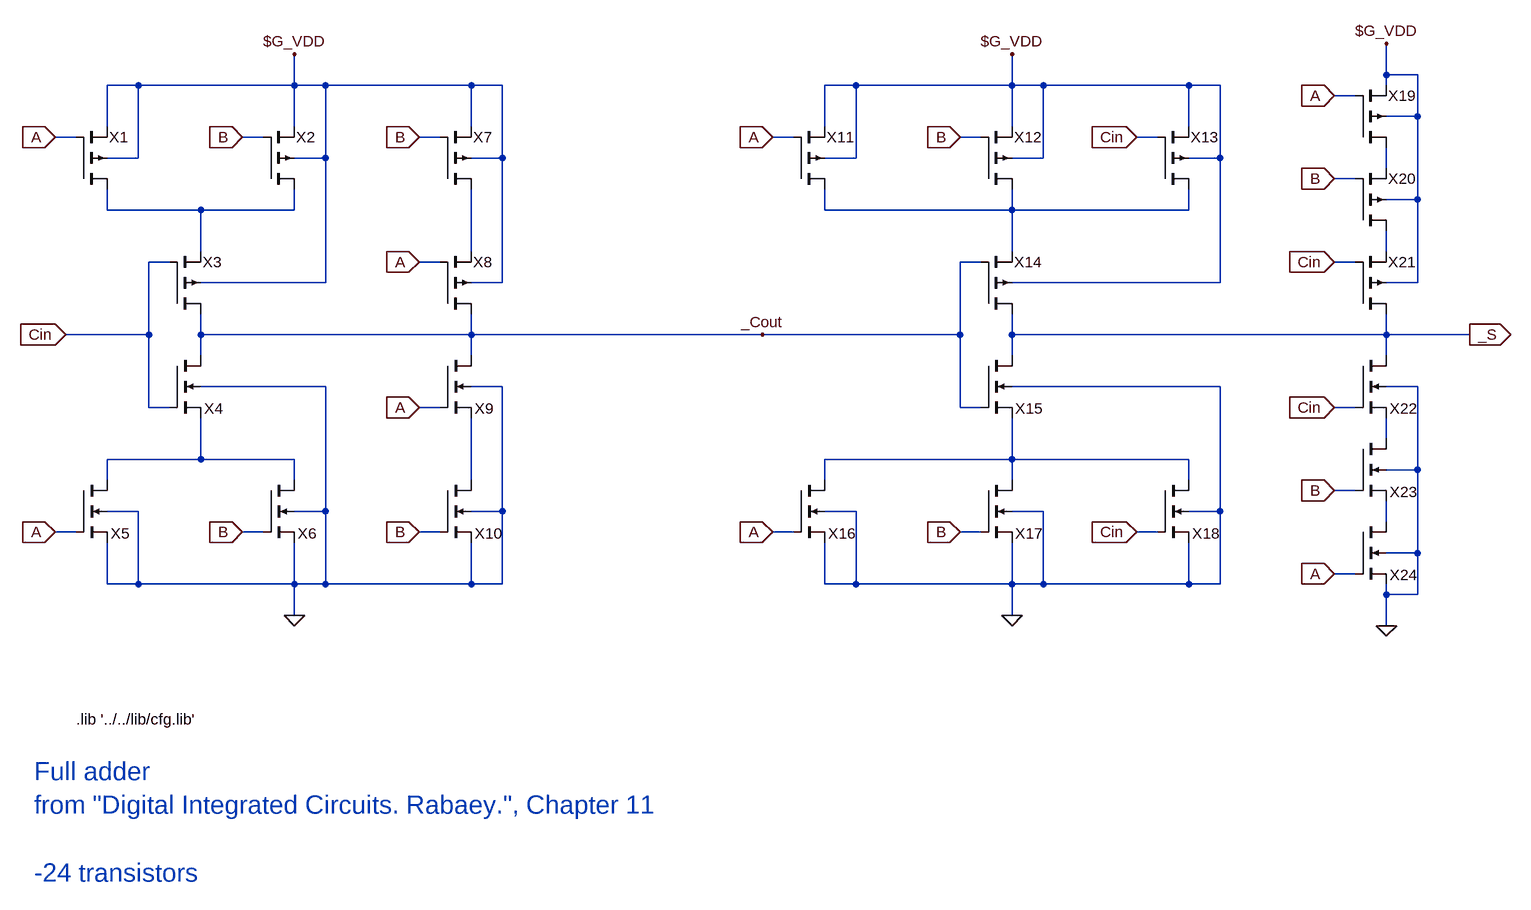
[diagram p0: schematic fa3.asc]
fa3.asc, the LTspice schematic file:
Version 4
SHEET 1 2652 2208
WIRE -3024 896 -3024 848
WIRE -2976 896 -3024 896
WIRE -4944 912 -4992 912
WIRE -4704 912 -4704 864
WIRE -4704 912 -4944 912
WIRE -4656 912 -4704 912
WIRE -4432 912 -4656 912
WIRE -4384 912 -4432 912
WIRE -3840 912 -3888 912
WIRE -3600 912 -3600 864
WIRE -3600 912 -3840 912
WIRE -3552 912 -3600 912
WIRE -3328 912 -3552 912
WIRE -3280 912 -3328 912
WIRE -3024 912 -3024 896
WIRE -3072 928 -3104 928
WIRE -2976 960 -2976 896
WIRE -2976 960 -3024 960
WIRE -4992 976 -4992 912
WIRE -4704 976 -4704 912
WIRE -4432 976 -4432 912
WIRE -3888 976 -3888 912
WIRE -3600 976 -3600 912
WIRE -3328 976 -3328 912
WIRE -5040 992 -5072 992
WIRE -4752 992 -4784 992
WIRE -4480 992 -4512 992
WIRE -3936 992 -3968 992
WIRE -3648 992 -3680 992
WIRE -3376 992 -3408 992
WIRE -4944 1024 -4944 912
WIRE -4944 1024 -4992 1024
WIRE -4656 1024 -4656 912
WIRE -4656 1024 -4704 1024
WIRE -4384 1024 -4384 912
WIRE -4384 1024 -4432 1024
WIRE -3840 1024 -3840 912
WIRE -3840 1024 -3888 1024
WIRE -3552 1024 -3552 912
WIRE -3552 1024 -3600 1024
WIRE -3280 1024 -3280 912
WIRE -3280 1024 -3328 1024
WIRE -3024 1040 -3024 1008
WIRE -3072 1056 -3104 1056
WIRE -2976 1088 -2976 960
WIRE -2976 1088 -3024 1088
WIRE -4992 1104 -4992 1072
WIRE -4848 1104 -4992 1104
WIRE -4704 1104 -4704 1072
WIRE -4704 1104 -4848 1104
WIRE -3888 1104 -3888 1072
WIRE -3600 1104 -3600 1072
WIRE -3600 1104 -3888 1104
WIRE -3328 1104 -3328 1072
WIRE -3328 1104 -3600 1104
WIRE -4848 1168 -4848 1104
WIRE -4432 1168 -4432 1072
WIRE -3600 1168 -3600 1104
WIRE -3024 1168 -3024 1136
WIRE -4896 1184 -4928 1184
WIRE -4480 1184 -4512 1184
WIRE -3648 1184 -3680 1184
WIRE -3072 1184 -3104 1184
WIRE -4656 1216 -4656 1024
WIRE -4656 1216 -4848 1216
WIRE -4384 1216 -4384 1024
WIRE -4384 1216 -4432 1216
WIRE -3280 1216 -3280 1024
WIRE -3280 1216 -3600 1216
WIRE -2976 1216 -2976 1088
WIRE -2976 1216 -3024 1216
WIRE -4928 1296 -4928 1184
WIRE -4928 1296 -5056 1296
WIRE -4848 1296 -4848 1264
WIRE -4432 1296 -4432 1264
WIRE -4432 1296 -4848 1296
WIRE -3984 1296 -4432 1296
WIRE -3680 1296 -3680 1184
WIRE -3680 1296 -3984 1296
WIRE -3600 1296 -3600 1264
WIRE -3024 1296 -3024 1264
WIRE -3024 1296 -3600 1296
WIRE -2896 1296 -3024 1296
WIRE -4848 1328 -4848 1296
WIRE -4432 1328 -4432 1296
WIRE -3600 1328 -3600 1296
WIRE -3024 1328 -3024 1296
WIRE -4656 1376 -4848 1376
WIRE -4384 1376 -4432 1376
WIRE -3280 1376 -3600 1376
WIRE -2976 1376 -3024 1376
WIRE -4928 1408 -4928 1296
WIRE -4896 1408 -4928 1408
WIRE -4480 1408 -4512 1408
WIRE -3680 1408 -3680 1296
WIRE -3648 1408 -3680 1408
WIRE -3072 1408 -3104 1408
WIRE -3024 1456 -3024 1424
WIRE -4848 1488 -4848 1424
WIRE -4848 1488 -4992 1488
WIRE -4704 1488 -4848 1488
WIRE -3600 1488 -3600 1424
WIRE -3600 1488 -3888 1488
WIRE -3328 1488 -3600 1488
WIRE -2976 1504 -2976 1376
WIRE -2976 1504 -3024 1504
WIRE -4992 1520 -4992 1488
WIRE -4704 1520 -4704 1488
WIRE -4432 1520 -4432 1424
WIRE -3888 1520 -3888 1488
WIRE -3600 1520 -3600 1488
WIRE -3328 1520 -3328 1488
WIRE -3072 1536 -3104 1536
WIRE -4944 1568 -4992 1568
WIRE -4656 1568 -4656 1376
WIRE -4656 1568 -4704 1568
WIRE -4384 1568 -4384 1376
WIRE -4384 1568 -4432 1568
WIRE -3840 1568 -3888 1568
WIRE -3552 1568 -3600 1568
WIRE -3280 1568 -3280 1376
WIRE -3280 1568 -3328 1568
WIRE -3024 1584 -3024 1552
WIRE -5040 1600 -5072 1600
WIRE -4752 1600 -4784 1600
WIRE -4480 1600 -4512 1600
WIRE -3936 1600 -3968 1600
WIRE -3648 1600 -3680 1600
WIRE -3376 1600 -3408 1600
WIRE -2976 1632 -2976 1504
WIRE -2976 1632 -3024 1632
WIRE -3072 1664 -3104 1664
WIRE -4992 1680 -4992 1616
WIRE -4944 1680 -4944 1568
WIRE -4944 1680 -4992 1680
WIRE -4704 1680 -4704 1616
WIRE -4704 1680 -4944 1680
WIRE -4656 1680 -4656 1568
WIRE -4656 1680 -4704 1680
WIRE -4432 1680 -4432 1616
WIRE -4432 1680 -4656 1680
WIRE -4384 1680 -4384 1568
WIRE -4384 1680 -4432 1680
WIRE -3888 1680 -3888 1616
WIRE -3840 1680 -3840 1568
WIRE -3840 1680 -3888 1680
WIRE -3600 1680 -3600 1616
WIRE -3600 1680 -3840 1680
WIRE -3552 1680 -3552 1568
WIRE -3552 1680 -3600 1680
WIRE -3328 1680 -3328 1616
WIRE -3328 1680 -3552 1680
WIRE -3280 1680 -3280 1568
WIRE -3280 1680 -3328 1680
WIRE -3024 1696 -3024 1680
WIRE -2976 1696 -2976 1632
WIRE -2976 1696 -3024 1696
WIRE -4704 1728 -4704 1680
WIRE -3600 1728 -3600 1680
WIRE -3024 1744 -3024 1696
FLAG -4784 992 B
IOPIN -4784 992 In
FLAG -5072 992 A
IOPIN -5072 992 In
FLAG -4704 1728 0
FLAG -4704 864 $G_VDD
FLAG -5072 1600 A
IOPIN -5072 1600 In
FLAG -4784 1600 B
IOPIN -4784 1600 In
FLAG -5056 1296 Cin
IOPIN -5056 1296 In
FLAG -4512 992 B
IOPIN -4512 992 In
FLAG -4512 1184 A
IOPIN -4512 1184 In
FLAG -4512 1408 A
IOPIN -4512 1408 In
FLAG -4512 1600 B
IOPIN -4512 1600 In
FLAG -3984 1296 _Cout
FLAG -3680 992 B
IOPIN -3680 992 In
FLAG -3968 992 A
IOPIN -3968 992 In
FLAG -3600 864 $G_VDD
FLAG -3408 992 Cin
IOPIN -3408 992 In
FLAG -3600 1728 0
FLAG -3968 1600 A
IOPIN -3968 1600 In
FLAG -3680 1600 B
IOPIN -3680 1600 In
FLAG -3408 1600 Cin
IOPIN -3408 1600 In
FLAG -3104 1056 B
IOPIN -3104 1056 In
FLAG -3104 1184 Cin
IOPIN -3104 1184 In
FLAG -3104 928 A
IOPIN -3104 928 In
FLAG -3024 848 $G_VDD
FLAG -3104 1408 Cin
IOPIN -3104 1408 In
FLAG -3104 1536 B
IOPIN -3104 1536 In
FLAG -3104 1664 A
IOPIN -3104 1664 In
FLAG -3024 1744 0
FLAG -2896 1296 _S
IOPIN -2896 1296 Out
SYMBOL pmos4 -4896 1264 M180
WINDOW 0 51 80 Left 2
WINDOW 3 52 23 Invisible 2
SYMATTR InstName X3
SYMATTR Value pmos_t1
SYMATTR Prefix X
SYMBOL nmos4 -4896 1328 R0
WINDOW 0 53 82 Left 2
WINDOW 3 53 23 Invisible 2
SYMATTR InstName X4
SYMATTR Value nmos_t1
SYMATTR Prefix X
SYMBOL pmos4 -5040 1072 M180
WINDOW 0 51 80 Left 2
WINDOW 3 52 23 Invisible 2
SYMATTR InstName X1
SYMATTR Value pmos_t1
SYMATTR Prefix X
SYMBOL pmos4 -4752 1072 M180
WINDOW 0 51 80 Left 2
WINDOW 3 52 23 Invisible 2
SYMATTR InstName X2
SYMATTR Value pmos_t1
SYMATTR Prefix X
SYMBOL nmos4 -5040 1520 R0
WINDOW 0 53 82 Left 2
WINDOW 3 53 23 Invisible 2
SYMATTR InstName X5
SYMATTR Value nmos_t1
SYMATTR Prefix X
SYMBOL nmos4 -4752 1520 R0
WINDOW 0 53 82 Left 2
WINDOW 3 53 23 Invisible 2
SYMATTR InstName X6
SYMATTR Value nmos_t1
SYMATTR Prefix X
SYMBOL pmos4 -4480 1072 M180
WINDOW 0 51 80 Left 2
WINDOW 3 52 23 Invisible 2
SYMATTR InstName X7
SYMATTR Value pmos_t1
SYMATTR Prefix X
SYMBOL pmos4 -4480 1264 M180
WINDOW 0 51 80 Left 2
WINDOW 3 52 23 Invisible 2
SYMATTR InstName X8
SYMATTR Value pmos_t1
SYMATTR Prefix X
SYMBOL nmos4 -4480 1328 R0
WINDOW 0 53 82 Left 2
WINDOW 3 53 23 Invisible 2
SYMATTR InstName X9
SYMATTR Value nmos_t1
SYMATTR Prefix X
SYMBOL nmos4 -4480 1520 R0
WINDOW 0 53 82 Left 2
WINDOW 3 53 23 Invisible 2
SYMATTR InstName X10
SYMATTR Value nmos_t1
SYMATTR Prefix X
SYMBOL pmos4 -3648 1264 M180
WINDOW 0 51 80 Left 2
WINDOW 3 52 23 Invisible 2
SYMATTR InstName X14
SYMATTR Value pmos_t1
SYMATTR Prefix X
SYMBOL nmos4 -3648 1328 R0
WINDOW 0 53 82 Left 2
WINDOW 3 53 23 Invisible 2
SYMATTR InstName X15
SYMATTR Value nmos_t1
SYMATTR Prefix X
SYMBOL pmos4 -3936 1072 M180
WINDOW 0 51 80 Left 2
WINDOW 3 52 23 Invisible 2
SYMATTR InstName X11
SYMATTR Value pmos_t1
SYMATTR Prefix X
SYMBOL pmos4 -3648 1072 M180
WINDOW 0 51 80 Left 2
WINDOW 3 52 23 Invisible 2
SYMATTR InstName X12
SYMATTR Value pmos_t1
SYMATTR Prefix X
SYMBOL pmos4 -3376 1072 M180
WINDOW 0 51 80 Left 2
WINDOW 3 52 23 Invisible 2
SYMATTR InstName X13
SYMATTR Value pmos_t1
SYMATTR Prefix X
SYMBOL nmos4 -3936 1520 R0
WINDOW 0 53 82 Left 2
WINDOW 3 53 23 Invisible 2
SYMATTR InstName X16
SYMATTR Value nmos_t1
SYMATTR Prefix X
SYMBOL nmos4 -3648 1520 R0
WINDOW 0 53 82 Left 2
WINDOW 3 53 23 Invisible 2
SYMATTR InstName X17
SYMATTR Value nmos_t1
SYMATTR Prefix X
SYMBOL nmos4 -3376 1520 R0
WINDOW 0 53 82 Left 2
WINDOW 3 53 23 Invisible 2
SYMATTR InstName X18
SYMATTR Value nmos_t1
SYMATTR Prefix X
SYMBOL pmos4 -3072 1136 M180
WINDOW 0 51 80 Left 2
WINDOW 3 52 23 Invisible 2
SYMATTR InstName X20
SYMATTR Value pmos_t1
SYMATTR Prefix X
SYMBOL pmos4 -3072 1264 M180
WINDOW 0 51 80 Left 2
WINDOW 3 52 23 Invisible 2
SYMATTR InstName X21
SYMATTR Value pmos_t1
SYMATTR Prefix X
SYMBOL pmos4 -3072 1008 M180
WINDOW 0 51 80 Left 2
WINDOW 3 52 23 Invisible 2
SYMATTR InstName X19
SYMATTR Value pmos_t1
SYMATTR Prefix X
SYMBOL nmos4 -3072 1328 R0
WINDOW 0 53 82 Left 2
WINDOW 3 53 23 Invisible 2
SYMATTR InstName X22
SYMATTR Value nmos_t1
SYMATTR Prefix X
SYMBOL nmos4 -3072 1456 R0
WINDOW 0 53 82 Left 2
WINDOW 3 53 23 Invisible 2
SYMATTR InstName X23
SYMATTR Value nmos_t1
SYMATTR Prefix X
SYMBOL nmos4 -3072 1584 R0
WINDOW 0 53 82 Left 2
WINDOW 3 53 23 Invisible 2
SYMATTR InstName X24
SYMATTR Value nmos_t1
SYMATTR Prefix X
TEXT -5040 1888 Left 2 !.lib '../../lib/cfg.lib'
TEXT -5104 1968 Left 4 ;Full adder\nfrom "Digital Integrated Circuits. Rabaey.", Chapter 11\n \n-24 transistors

The netlist it stands for:
* fa3.asc
XX3 _Cout Cin N002 $G_VDD pmos_t1  ; pins D G S B
XX4 _Cout Cin N007 0 nmos_t1  ; pins D G S B
XX1 N002 A $G_VDD $G_VDD pmos_t1  ; pins D G S B
XX2 N002 B $G_VDD $G_VDD pmos_t1  ; pins D G S B
XX5 N007 A 0 0 nmos_t1  ; pins D G S B
XX6 N007 B 0 0 nmos_t1  ; pins D G S B
XX7 N004 B $G_VDD $G_VDD pmos_t1  ; pins D G S B
XX8 _Cout A N004 $G_VDD pmos_t1  ; pins D G S B
XX9 _Cout A N009 0 nmos_t1  ; pins D G S B
XX10 N009 B 0 0 nmos_t1  ; pins D G S B
XX14 _S _Cout N003 $G_VDD pmos_t1  ; pins D G S B
XX15 _S _Cout N008 0 nmos_t1  ; pins D G S B
XX11 N003 A $G_VDD $G_VDD pmos_t1  ; pins D G S B
XX12 N003 B $G_VDD $G_VDD pmos_t1  ; pins D G S B
XX13 N003 Cin $G_VDD $G_VDD pmos_t1  ; pins D G S B
XX16 N008 A 0 0 nmos_t1  ; pins D G S B
XX17 N008 B 0 0 nmos_t1  ; pins D G S B
XX18 N008 Cin 0 0 nmos_t1  ; pins D G S B
XX20 N005 B N001 $G_VDD pmos_t1  ; pins D G S B
XX21 _S Cin N005 $G_VDD pmos_t1  ; pins D G S B
XX19 N001 A $G_VDD $G_VDD pmos_t1  ; pins D G S B
XX22 _S Cin N006 0 nmos_t1  ; pins D G S B
XX23 N006 B N010 0 nmos_t1  ; pins D G S B
XX24 N010 A 0 0 nmos_t1  ; pins D G S B
.lib '../../lib/cfg.lib'
* Full adder
* from "Digital Integrated Circuits. Rabaey.", Chapter 11
* -24 transistors
.backanno
.end